# EasyEDA schematic SCH_ESP32 Controller PoE_2022-09-25.json
TITLE: ESP-R8-POE-3; REV: 3; Date: 2021-06-01; Sheet: 1/1; Drawn By: Dan Copeland; Company: None
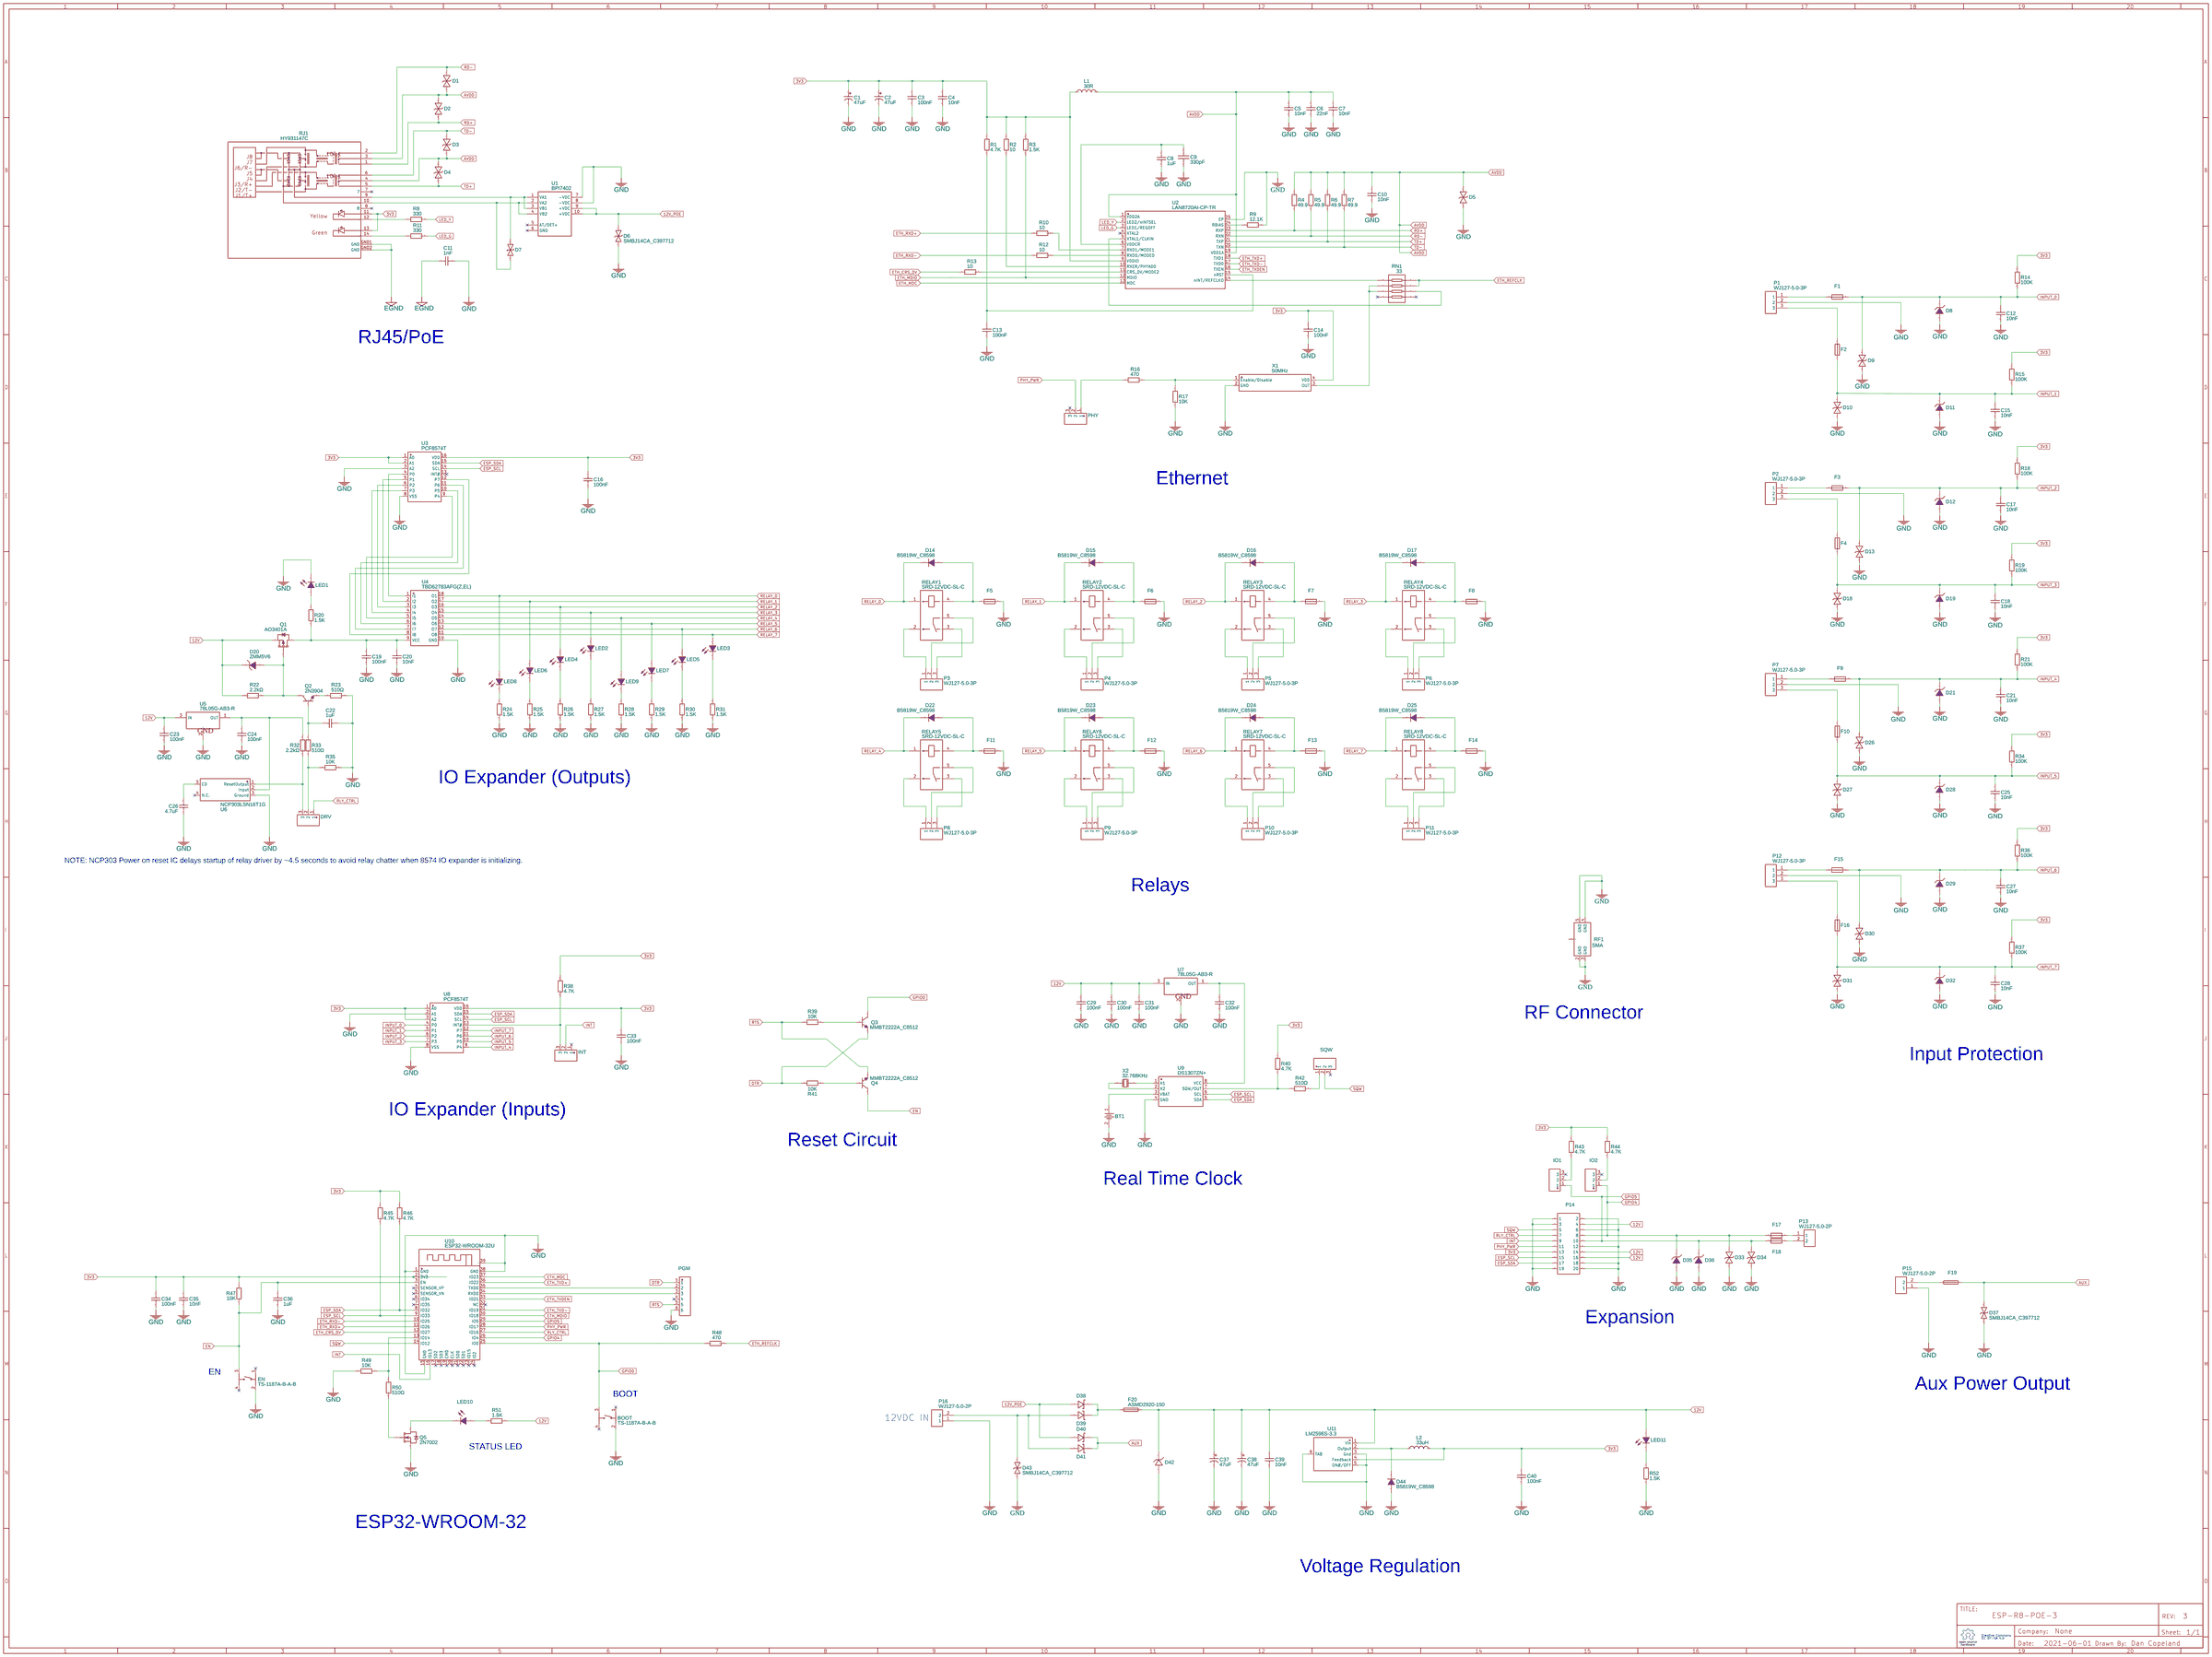
[diagram p0: schematic sheet]

## Parts
BOOT  TS-1187A-B-A-B  [SW-SMD_4P-L5.1-W5.1-P3.70-LS6.5-TL-2]
BT1  BS-12-A1AJ002-F  [BAT-TH_BS-12-A1AJ002-F]
C1  47uF  [CAP-TH_BD5.0-P2.00-D0.8-FD]
C2  47uF  [CAP-TH_BD5.0-P2.00-D0.8-FD]
C3  100nF  [C0402_NEW]
C4  10nF  [C0402]
C5  10nF  [C0402]
C6  22nF  [C0402]
C7  10nF  [C0402]
C8  1uF  [C0603]
C9  330pF  [C0402]
C10  10nF  [C0402]
C11  1nF  [C1206]
C12  10nF  [C0402]
C13  100nF  [C0402_NEW]
C14  100nF  [C0402_NEW]
C15  10nF  [C0402]
C16  100nF  [C0402_NEW]
C17  10nF  [C0402]
C18  10nF  [C0402]
C19  100nF  [C0402_NEW]
C20  10nF  [C0805]
C21  10nF  [C0402]
C22  1uF  [C0603]
C23  100nF  [C0402_NEW]
C24  100nF  [C0402_NEW]
C25  10nF  [C0402]
C26  4.7uF  [C1206]
C27  10nF  [C0402]
C28  10nF  [C0402]
C29  100nF  [C0402_NEW]
C30  100nF  [C0402_NEW]
C31  100nF  [C0402_NEW]
C32  100nF  [C0402_NEW]
C33  100nF  [C0402_NEW]
C34  100nF  [C0402_NEW]
C35  10nF  [C0402]
C36  1uF  [C0603]
C37  47uF  [CAP-TH_BD5.0-P2.00-D0.8-FD]
C38  47uF  [CAP-TH_BD5.0-P2.00-D0.8-FD]
C39  10nF  [C0805]
C40  100nF  [C0402_NEW]
D1  PESD03V32D-LC  [SOD-323_L1.7-W1.3-LS2.5-BI]
D2  PESD03V32D-LC  [SOD-323_L1.7-W1.3-LS2.5-BI]
D3  PESD03V32D-LC  [SOD-323_L1.7-W1.3-LS2.5-BI]
D4  PESD03V32D-LC  [SOD-323_L1.7-W1.3-LS2.5-BI]
D5  PESD03V32D-LC  [SOD-323_L1.7-W1.3-LS2.5-BI]
D6  SMBJ14CA_C397712  [SMB_L4.4-W3.6-LS5.4-BI]
D7  SMBJ64CA  [SMB_L4.6-W3.6-LS5.3-BI]
D8  ZMM3V3  [LL-34_L3.5-W1.5-RD]
D9  PESD03V32D-LC  [SOD-323_L1.7-W1.3-LS2.5-BI]
D10  PESD03V32D-LC  [SOD-323_L1.7-W1.3-LS2.5-BI]
D11  ZMM3V3  [LL-34_L3.5-W1.5-RD]
D12  ZMM3V3  [LL-34_L3.5-W1.5-RD]
D13  PESD03V32D-LC  [SOD-323_L1.7-W1.3-LS2.5-BI]
D14  B5819W_C8598  [SOD-123_L2.8-W1.8-LS3.7-RD]
D15  B5819W_C8598  [SOD-123_L2.8-W1.8-LS3.7-RD]
D16  B5819W_C8598  [SOD-123_L2.8-W1.8-LS3.7-RD]
D17  B5819W_C8598  [SOD-123_L2.8-W1.8-LS3.7-RD]
D18  PESD03V32D-LC  [SOD-323_L1.7-W1.3-LS2.5-BI]
D19  ZMM3V3  [LL-34_L3.5-W1.5-RD]
D20  ZMM5V6  [LL-34_L3.5-W1.5-RD]
D21  ZMM3V3  [LL-34_L3.5-W1.5-RD]
D22  B5819W_C8598  [SOD-123_L2.8-W1.8-LS3.7-RD]
D23  B5819W_C8598  [SOD-123_L2.8-W1.8-LS3.7-RD]
D24  B5819W_C8598  [SOD-123_L2.8-W1.8-LS3.7-RD]
D25  B5819W_C8598  [SOD-123_L2.8-W1.8-LS3.7-RD]
D26  PESD03V32D-LC  [SOD-323_L1.7-W1.3-LS2.5-BI]
D27  PESD03V32D-LC  [SOD-323_L1.7-W1.3-LS2.5-BI]
D28  ZMM3V3  [LL-34_L3.5-W1.5-RD]
D29  ZMM3V3  [LL-34_L3.5-W1.5-RD]
D30  PESD03V32D-LC  [SOD-323_L1.7-W1.3-LS2.5-BI]
D31  PESD03V32D-LC  [SOD-323_L1.7-W1.3-LS2.5-BI]
D32  ZMM3V3  [LL-34_L3.5-W1.5-RD]
D33  PESD03V32D-LC  [SOD-323_L1.7-W1.3-LS2.5-BI]
D34  PESD03V32D-LC  [SOD-323_L1.7-W1.3-LS2.5-BI]
D35  ZMM3V3  [LL-34_L3.5-W1.5-RD]
D36  ZMM3V3  [LL-34_L3.5-W1.5-RD]
D37  SMBJ14CA_C397712  [SMB_L4.4-W3.6-LS5.4-BI]
D38  SS34_C8678  [DO-214AC_L4.3-W2.7-LS5.3-RD]
D39  SS34_C8678  [DO-214AC_L4.3-W2.7-LS5.3-RD]
D40  SS34_C8678  [DO-214AC_L4.3-W2.7-LS5.3-RD]
D41  SS34_C8678  [DO-214AC_L4.3-W2.7-LS5.3-RD]
D42  2EZ13D5_C388131  [DO-41_BD2.4-L4.7-P8.70-D0.9-RD]
D43  SMBJ14CA_C397712  [SMB_L4.4-W3.6-LS5.4-BI]
D44  B5819W_C8598  [SOD-123_L2.8-W1.8-LS3.7-RD]
DRV  X1311WV-03J-C18D27  [HDR-TH_3P-P1.27-V-M]
EN  TS-1187A-B-A-B  [SW-SMD_4P-L5.1-W5.1-P3.70-LS6.5-TL-2]
F1  BSMD0603-002-60V  [F0603]
F2  BSMD0603-002-60V  [F0603]
F3  BSMD0603-002-60V  [F0603]
F4  BSMD0603-002-60V  [F0603]
F5  BSMD0603-025-16V  [F0603]
F6  BSMD0603-025-16V  [F0603]
F7  BSMD0603-025-16V  [F0603]
F8  BSMD0603-025-16V  [F0603]
F9  BSMD0603-002-60V  [F0603]
F10  BSMD0603-002-60V  [F0603]
F11  BSMD0603-025-16V  [F0603]
F12  BSMD0603-025-16V  [F0603]
F13  BSMD0603-025-16V  [F0603]
F14  BSMD0603-025-16V  [F0603]
F15  BSMD0603-002-60V  [F0603]
F16  BSMD0603-002-60V  [F0603]
F17  BSMD0603-002-60V  [F0603]
F18  BSMD0603-002-60V  [F0603]
F19  ASMD2920-075  [F2920]
F20  ASMD2920-150  [F2920]
INT  X1311WV-03J-C18D27  [HDR-TH_3P-P1.27-V-M]
IO1  X1311WV-03J-C18D27  [HDR-TH_3P-P1.27-V-M]
IO2  X1311WV-03J-C18D27  [HDR-TH_3P-P1.27-V-M]
L1  30R  [L0805]
L2  33uH  [IND-TH_BD9.0-P3.50-D0.6_VL0810]
LED1  19-217/BHC-ZL1M2RY/3T  [LED0603-R-RD]
LED2  19-217/BHC-ZL1M2RY/3T  [LED0603-R-RD]
LED3  19-217/BHC-ZL1M2RY/3T  [LED0603-R-RD]
LED4  19-217/BHC-ZL1M2RY/3T  [LED0603-R-RD]
LED5  19-217/BHC-ZL1M2RY/3T  [LED0603-R-RD]
LED6  19-217/BHC-ZL1M2RY/3T  [LED0603-R-RD]
LED7  19-217/BHC-ZL1M2RY/3T  [LED0603-R-RD]
LED8  19-217/BHC-ZL1M2RY/3T  [LED0603-R-RD]
LED9  19-217/BHC-ZL1M2RY/3T  [LED0603-R-RD]
LED10  19-217/BHC-ZL1M2RY/3T  [LED0603-R-RD]
LED11  19-217/BHC-ZL1M2RY/3T  [LED0603-R-RD]
P1  WJ127-5.0-3P  [CONN-TH_3P-P5.00_WJ127-5.0-3P]
P2  WJ127-5.0-3P  [CONN-TH_3P-P5.00_WJ127-5.0-3P]
P3  WJ127-5.0-3P  [CONN-TH_3P-P5.00_WJ127-5.0-3P]
P4  WJ127-5.0-3P  [CONN-TH_3P-P5.00_WJ127-5.0-3P]
P5  WJ127-5.0-3P  [CONN-TH_3P-P5.00_WJ127-5.0-3P]
P6  WJ127-5.0-3P  [CONN-TH_3P-P5.00_WJ127-5.0-3P]
P7  WJ127-5.0-3P  [CONN-TH_3P-P5.00_WJ127-5.0-3P]
P8  WJ127-5.0-3P  [CONN-TH_3P-P5.00_WJ127-5.0-3P]
P9  WJ127-5.0-3P  [CONN-TH_3P-P5.00_WJ127-5.0-3P]
P10  WJ127-5.0-3P  [CONN-TH_3P-P5.00_WJ127-5.0-3P]
P11  WJ127-5.0-3P  [CONN-TH_3P-P5.00_WJ127-5.0-3P]
P12  WJ127-5.0-3P  [CONN-TH_3P-P5.00_WJ127-5.0-3P]
P13  WJ127-5.0-2P  [CONN-TH_2P-P5.00_CPC3703CTR]
P14  Header-Female-2.54_2x10  [HDR-TH_20P-P2.54-V-R2-C10-S2.54]
P15  WJ127-5.0-2P  [CONN-TH_2P-P5.00_CPC3703CTR]
P16  WJ127-5.0-2P  [CONN-TH_2P-P5.00_CPC3703CTR]
PGM  PZ254V-11-06P  [HDR-TH_6P-P2.54-V-M]
PHY  X1311WV-03J-C18D27  [HDR-TH_3P-P1.27-V-M]
Q1  AO3401A  [SOT-23_L2.9-W1.3-P1.90-LS2.4-BR]
Q2  2N3904  [SOT-23-3_L2.9-W1.3-P1.90-LS2.4-BR]
Q3  MMBT2222A_C8512  [SOT-23-3_L2.9-W1.3-P1.90-LS2.4-BR]
Q4  MMBT2222A_C8512  [SOT-23-3_L2.9-W1.3-P1.90-LS2.4-BR]
Q5  2N7002  [SOT-23-3_L2.9-W1.3-P1.90-LS2.4-BR]
R1  4.7K  [R0402]
R2  10  [R0402]
R3  1.5K  [R0402]
R4  49.9  [R0402]
R5  49.9  [R0402]
R6  49.9  [R0402]
R7  49.9  [R0402]
R8  330  [R0402]
R9  12.1K  [R0402]
R10  10  [R0402]
R11  330  [R0402]
R12  10  [R0402]
R13  10  [R0402]
R14  100K  [R0402]
R15  100K  [R0402]
R16  470  [R0402]
R17  10K  [R0402]
R18  100K  [R0402]
R19  100K  [R0402]
R20  1.5K  [R0603]
R21  100K  [R0402]
R22  2.2kΩ  [R0402]
R23  510Ω  [R0402]
R24  1.5K  [R0603]
R25  1.5K  [R0603]
R26  1.5K  [R0603]
R27  1.5K  [R0603]
R28  1.5K  [R0603]
R29  1.5K  [R0603]
R30  1.5K  [R0603]
R31  1.5K  [R0603]
R32  2.2kΩ  [R0402]
R33  510Ω  [R0402]
R34  100K  [R0402]
R35  10K  [R0402]
R36  100K  [R0402]
R37  100K  [R0402]
R38  4.7K  [R0402]
R39  10K  [R0402]
R40  4.7K  [R0402]
R41  10K  [R0402]
R42  510Ω  [R0402]
R43  4.7K  [R0402]
R44  4.7K  [R0402]
R45  4.7K  [R0402]
R46  4.7K  [R0402]
R47  10K  [R0402]
R48  470  [R0402]
R49  10K  [R0402]
R50  510Ω  [R0402]
R51  1.5K  [R0603]
R52  1.5K  [R0603]
RELAY1  SRD-12VDC-SL-C  [RELAY-TH_SRD-XXVDC-XL-C]
RELAY2  SRD-12VDC-SL-C  [RELAY-TH_SRD-XXVDC-XL-C]
RELAY3  SRD-12VDC-SL-C  [RELAY-TH_SRD-XXVDC-XL-C]
RELAY4  SRD-12VDC-SL-C  [RELAY-TH_SRD-XXVDC-XL-C]
RELAY5  SRD-12VDC-SL-C  [RELAY-TH_SRD-XXVDC-XL-C]
RELAY6  SRD-12VDC-SL-C  [RELAY-TH_SRD-XXVDC-XL-C]
RELAY7  SRD-12VDC-SL-C  [RELAY-TH_SRD-XXVDC-XL-C]
RELAY8  SRD-12VDC-SL-C  [RELAY-TH_SRD-XXVDC-XL-C]
RF1  SMA  [SMA-TH_HJ-SMA200]
RJ1  HY931147C  [RJ45-TH_HY931147C]
RN1  33  [RES-ARRAY-SMD_0402-8P-L2.0-W1.0-BL]
SQW  X1311WV-03J-C18D27  [HDR-TH_3P-P1.27-V-M]
U1  BPI7402  [BPI7402]
U2  LAN8720AI-CP-TR  [QFN-24_L4.0-W4.0-P0.50-BL-EP2.6]
U3  PCF8574T  [SO-16_L10.3-W7.5-P1.27-LS10.3-BL]
U4  TBD62783AFG(Z,EL)  [SOP-18_L13.0-W7.0-P1.27-LS10.3-BL]
U5  78L05G-AB3-R  [SOT-89-3_L4.5-W2.5-P1.50-LS4.2-BR]
U6  NCP303LSN16T1G  [TSOP-5_L3.0-W1.5-P0.95-LS2.8-BL]
U7  78L05G-AB3-R  [SOT-89-3_L4.5-W2.5-P1.50-LS4.2-BR]
U8  PCF8574T  [SO-16_L10.3-W7.5-P1.27-LS10.3-BL]
U9  DS1307ZN+  [SOP-8_L4.9-W3.9-P1.27-LS6.0-BL]
U10  ESP32-WROOM-32U  [WIFIM-SMD_38P-L19.2-W18.0-P1.27]
U11  LM2596S-3.3  [TO-263-5_L10.0-W8.4-P1.70-LS15.3-BR]
X1  50MHz  [OSC-SMD_4P-L7.0-W5.0-BL]
X2  32.768KHz  [OSC-TH_BD3.1-P0.8-D0.3]

## Library data of the parts
BOOT EN = TS-1187A-B-A-B: Supplier: LCSC; Supplier Part: C318884; Manufacturer: XKB Enterprise; Contributor: LCSC; JLCPCB Part Class: Basic Part
BT1 = BS-12-A1AJ002-F: Supplier: LCSC; Supplier Part: C964720; Manufacturer: MYOUNG(美阳); Contributor: LCSC; JLCPCB Part Class: Extended Part
C1 C2 C37 C38 = 16MS747MEFC5X7: Supplier: LCSC; Manufacturer: Rubycon; Contributor: LCSC; Supplier Part: C108854; JLCPCB Part Class: Extended Part
C3 C13 C14 C16 C19 C23 C24 C29-C34 C40 = CL05B104KO5NNNC: Supplier: LCSC; Manufacturer: SAMSUNG; Supplier Part: C1525; JLCPCB Part Class: Basic Part
C4 C5 C7 C10 C12 C15 C17 C18 C21 C25 C27 C28 C35 = CL05B103KB5NNNC: Supplier: LCSC; Manufacturer: SAMSUNG; Supplier Part: C15195; JLCPCB Part Class: Basic Part
C6 = 0402B223K500NT: Supplier: LCSC; Manufacturer: FH; Supplier Part: C1532; JLCPCB Part Class: Basic Part
C8 C22 C36 = CL10A105KB8NNNC: Supplier: LCSC; Manufacturer: SAMSUNG; Supplier Part: C15849; JLCPCB Part Class: Basic Part
C9 = CL05C331JB5NNNC: Supplier: LCSC; Manufacturer: SAMSUNG; Supplier Part: C13533; JLCPCB Part Class: Basic Part
C11 = 1206B102K202NT: Supplier: LCSC; Manufacturer: FH; Supplier Part: C9196; JLCPCB Part Class: Extended Part
C20 C39 = CL21B103KBANNNC: Supplier: LCSC; Manufacturer: SAMSUNG; Supplier Part: C1710; JLCPCB Part Class: Basic Part
C26 = 1206B475K500NT: Supplier: LCSC; Manufacturer: FH; Supplier Part: C29823; JLCPCB Part Class: Basic Part
D1-D5 D9 D10 D13 D18 D26 D27 D30 D31 D33 D34 = PESD03V32D-LC: Supplier: LCSC; Supplier Part: C2912528; Manufacturer: TECH PUBLIC(台舟); JLCPCB Part Class: Extended Part; Contributor: LCSC
D6 D37 D43 = SMBJ14CA_C397712: Supplier: LCSC; Supplier Part: C397712; Manufacturer: AnBon; Manufacturer Part: SMBJ14CA; Contributor: LCSC; JLCPCB Part Class: Extended Part
D7 = SMBJ64CA_C123975: Supplier: LCSC; Supplier Part: C123975; Manufacturer: Brightking Elec (TAIWAN); Contributor: LCSC; JLCPCB Part Class: Extended Part
D8 D11 D12 D19 D21 D28 D29 D32 D35 D36 = ZMM3V3: Supplier: LCSC; Manufacturer: SEMTECH; Supplier Part: C8056; JLCPCB Part Class: Basic Part
D14-D17 D22-D25 D44 = B5819W_C8598: Supplier: LCSC; Manufacturer: CJ; Manufacturer Part: B5819W; Supplier Part: C8598; JLCPCB Part Class: Basic Part
D20 = ZMM5V6: Supplier: LCSC; Manufacturer: SEMTECH; Supplier Part: C8062; JLCPCB Part Class: Basic Part
D38-D41 = SS34_C8678: Supplier: LCSC; Manufacturer Part: SS34; Manufacturer: MDD; Supplier Part: C8678; JLCPCB Part Class: Basic Part
D42 = 2EZ13D5_C388131: Supplier: LCSC; Supplier Part: C388131; Manufacturer: SUNMATE Elec; Manufacturer Part: 2EZ13D5; Contributor: LCSC; JLCPCB Part Class: Extended Part
DRV INT IO1 IO2 PHY SQW = X1311WV-03J-C18D27: Supplier: LCSC; Supplier Part: C2881648; Manufacturer: XKB Connectivity(中国星坤); Contributor: LCSC; JLCPCB Part Class: Extended Part
F1-F4 F9 F10 F15-F18 = BSMD0603-002-60V: Supplier: LCSC; Supplier Part: C914089; Manufacturer: BHFUSE; Contributor: LCSC; JLCPCB Part Class: Extended Part; Package Display: No
F5-F8 F11-F14 = BSMD0603-025-16V: Supplier: LCSC; Supplier Part: C883094; Manufacturer: BHFUSE; Contributor: LCSC; JLCPCB Part Class: Extended Part
F19 = ASMD2920-075: Supplier: LCSC; Manufacturer: JDTFUSE; Contributor: LCSC; Supplier Part: C135375; JLCPCB Part Class: Extended Part; Package Display: No
F20 = ASMD2920-150: Supplier: LCSC; Manufacturer: JDTFUSE; Contributor: LCSC; Supplier Part: C135378; JLCPCB Part Class: Extended Part
L1 = SBM2012G300LSP: Supplier: LCSC; Supplier Part: C216133; Manufacturer: Sunltech Tech; Contributor: LCSC; JLCPCB Part Class: Extended Part
L2 = VLU0810-330K: Supplier: LCSC; Manufacturer: FH; Supplier Part: C72622; JLCPCB Part Class: Extended Part
LED1-LED11 = 19-217/BHC-ZL1M2RY/3T: Supplier: LCSC; Manufacturer: EVERLIGHT; Supplier Part: C72041; JLCPCB Part Class: Basic Part
P1-P12 = WJ127-5.0-3P: Supplier: LCSC; Manufacturer: ReliaPro; Supplier Part: C8393; JLCPCB Part Class: Extended Part
P13 P15 P16 = WJ127-5.0-2P: Supplier: LCSC; Manufacturer: ReliaPro; Supplier Part: C3703; JLCPCB Part Class: Extended Part
P14 = Header-Female-2.54_2x10: Supplier: LCSC; Manufacturer: BOOMELE; Manufacturer Part: 2.54mm,2×10Double row female; Supplier Part: C30867; JLCPCB Part Class: Extended Part
PGM = PZ254V-11-06P: Supplier: LCSC; Supplier Part: C492405; Manufacturer: XFCN; Contributor: LCSC; JLCPCB Part Class: Extended Part
Q1 = AO3401A: Supplier: LCSC; Manufacturer: AOS; Supplier Part: C15127; JLCPCB Part Class: Basic Part
Q2 = MMBT3904-C20526: Supplier: LCSC; Manufacturer: CJ; Manufacturer Part: MMBT3904; Supplier Part: C20526; Contributor: 立创EDA官方封装库; JLCPCB Part Class: Basic Part; Package Display: No
Q3 Q4 = MMBT2222A_C8512: Supplier: LCSC; Manufacturer: CJ; Manufacturer Part: MMBT2222A; Supplier Part: C8512; JLCPCB Part Class: Basic Part
Q5 = 2N7002: Supplier: LCSC; Manufacturer: CJ; Supplier Part: C8545; JLCPCB Part Class: Basic Part
R1 R38 R40 R43-R46 = 0402WGF4701TCE: Supplier: LCSC; Manufacturer: UniOhm; Supplier Part: C25900; JLCPCB Part Class: Basic Part
R2 R10 R12 R13 = 0402WGF100JTCE: Supplier: LCSC; Manufacturer: UniOhm; Supplier Part: C25077; JLCPCB Part Class: Basic Part
R3 = 0402WGF1501TCE: Supplier: LCSC; Manufacturer: UniOhm; Supplier Part: C25867; JLCPCB Part Class: Basic Part
R4-R7 = 0402WGF499JTCE: Supplier: LCSC; Manufacturer: UniOhm; Supplier Part: C25120; JLCPCB Part Class: Basic Part
R8 R11 = 0402WGF3300TCE: Supplier: LCSC; Manufacturer: UniOhm; Supplier Part: C25104; JLCPCB Part Class: Basic Part
R9 = 0402WGF1212TCE: Supplier: LCSC; Manufacturer: UniOhm; Supplier Part: C25852; JLCPCB Part Class: Extended Part
R14 R15 R18 R19 R21 R34 R36 R37 = 0402WGF1003TCE: Supplier: LCSC; Manufacturer: UniOhm; Supplier Part: C25741; JLCPCB Part Class: Basic Part
R16 R48 = 0402WGF4700TCE: Supplier: LCSC; Manufacturer: UniOhm; Supplier Part: C25117; JLCPCB Part Class: Basic Part
R17 R35 R39 R41 R47 R49 = 0402WGF1002TCE: Supplier: LCSC; Manufacturer: UniOhm; Supplier Part: C25744; JLCPCB Part Class: Basic Part
R20 R24-R31 R51 R52 = 0603WAF1501T5E: Supplier: LCSC; Manufacturer: UniOhm; Supplier Part: C22843; JLCPCB Part Class: Basic Part
R22 R32 = 0402WGF2201TCE: Supplier: LCSC; Manufacturer: UniOhm; Supplier Part: C25879; Resistance (Ohms): 2.2K; JLCPCB Part Class: Basic Part
R23 R33 R42 R50 = 0402WGF5100TCE: Supplier: LCSC; Manufacturer: UniOhm; Supplier Part: C25123; Resistance (Ohms): 510; JLCPCB Part Class: Basic Part
RELAY1-RELAY8 = SRD-12VDC-SL-C: Supplier: LCSC; Manufacturer: SONGLE; Supplier Part: C30431; JLCPCB Part Class: Extended Part
RF1 = HJ-SMA200: Supplier: LCSC; Supplier Part: C1509215; Manufacturer: 皇捷; Contributor: LCSC; JLCPCB Part Class: Extended Part
RJ1 = HY931147C: Supplier: LCSC; Manufacturer: HANRUN; Supplier Part: C91754; JLCPCB Part Class: Extended Part
RN1 = 4D02WGJ0330TCE: Supplier: LCSC; Manufacturer: UniOhm; Supplier Part: C25501; JLCPCB Part Class: Basic Part
U1 = BPI7402: Contributor: dirtypolecat
U2 = LAN8720AI-CP-TR: Supplier: LCSC; Manufacturer: SMSC; Supplier Part: C17146; JLCPCB Part Class: Extended Part
U3 U8 = PCF8574T_C2973152: Supplier: LCSC; Supplier Part: C2973152; Manufacturer: HGSEMI(华冠); link: https://atta.szlcsc.com//upload/public/pdf/source/20190611/C398075_1925312D8618E19C6137781D5B71A3CA.pdf; Contributor: LCSC; JLCPCB Part Class: Extended Part
U4 = TBD62783AFG(Z,EL): Supplier: LCSC; Supplier Part: C840444; Manufacturer: TOSHIBA(东芝); Contributor: LCSC; JLCPCB Part Class: Extended Part
U5 U7 = 78L05G-AB3-R: Supplier: LCSC; Manufacturer: UTC; Supplier Part: C71136; JLCPCB Part Class: Basic Part
U6 = NCP303LSN16T1G: Supplier: LCSC; Supplier Part: C892351; Manufacturer: onsemi(安森美); Contributor: LCSC
U9 = DS1307ZN+: Supplier: LCSC; Manufacturer: MAXIM; Supplier Part: C26858; JLCPCB Part Class: Extended Part
U10 = ESP32-WROOM-32U: Supplier: LCSC; Supplier Part: C328062; Manufacturer: Espressif Systems; Contributor: LCSC; JLCPCB Part Class: Extended Part
U11 = LM2596S-3.3: Supplier: LCSC; Supplier Part: C347420; Manufacturer: UMW(Youtai Semiconductor Co., Ltd.); Contributor: LCSC; Paste Type: Extended Part; JLCPCB Part Class: Extended Part
X1 = OT705050MJBA4SL: Supplier: LCSC; Supplier Part: C669094; Manufacturer: Yangxing Tech; Contributor: LCSC; JLCPCB Part Class: Extended Part
X2 = TDXLF-308 32.768KHZ 12.5PF 20PPM: Supplier: LCSC; Supplier Part: C145164; Manufacturer: Zhejiang Abel Elec; Contributor: LCSC; JLCPCB Part Class: Extended Part

## Nets
3V3: C1.1 C2.1 C3.1 C4.1 C14.1 C16.1 C33.1 C34.1 C35.1 C40.1 L1.1 L2.2 P14.13 R1.1 R2.1 R3.1 R14.1 R15.1 R18.1 R19.1 R21.1 R34.1 R36.1 R37.1 R38.1 R40.1 R43.1 R44.1 R45.1 R46.1 R47.1 RJ1.11 RJ1.13 U2.9(VDDIO) U3.1(A0) U3.2(A1) U3.16(VDD) U8.1(A0) U8.3(A2) U8.16(VDD) U10.2(3V3) U11.4(Feedback) X1.4(VDD)
12V: C23.1 C29.1 C30.1 C31.1 C37.1 C38.1 C39.1 D20.1(C) D42.1(C) F20.2 LED11.1(A) P14.4 P14.14 P14.16 Q1.2(S) R22.1 R51.1 U5.3(IN) U7.3(IN) U11.1(Vin)
12V_POE: D6.1 D38.2(A) D40.2(A) U1.9(+VDC) U1.10(+VDC)
AVDD: C5.1 C6.1 C7.1 C10.1 D1.2 D2.1 D3.2 D4.1 D5.1 L1.2 R4.1 R5.1 R6.1 R7.1 RJ1.3 RJ1.4 U2.1(VDD2A) U2.19(VDD1A)
GND: BOOT.2(B) BT1.2 C1.2 C2.2 C3.2 C4.2 C5.2 C6.2 C7.2 C8.2 C9.2 C10.2 C11.2 C12.2 C13.2 C14.2 C15.2 C16.2 C17.2 C18.2 C19.2 C20.2 C21.2 C22.2 C23.2 C24.2 C25.2 C26.1 C27.2 C28.2 C29.2 C30.2 C31.2 C32.2 C33.2 C34.2 C35.2 C36.2 C37.2 C38.2 C39.2 C40.2 D5.2 D6.2 D8.2(A) D9.2 D10.2 D11.2(A) D12.2(A) D13.2 D18.2 D19.2(A) D21.2(A) D26.2 D27.2 D28.2(A) D29.2(A) D30.2 D31.2 D32.2(A) D33.2 D34.2 D35.2(A) D36.2(A) D37.2 D42.2(A) D43.2 D44.2(+) EN.2(B) F5.2 F6.2 F7.2 F8.2 F11.2 F12.2 F13.2 F14.2 LED1.2(C) P1.2 P2.2 P7.2 P12.2 P14.1 P14.2 P14.3 P14.6 P14.12 P14.18 P14.19 P14.20 P15.1 P16.1 PGM.6 Q5.2(S) R9.2 R17.2 R23.2 R24.2 R25.2 R26.2 R27.2 R28.2 R29.2 R30.2 R31.2 R35.1 R49.2 R52.2 RF1.2(GND) RF1.3(GND) RF1.4(GND) RF1.5(GND) U1.7(-VDC) U1.8(-VDC) U2.25(EP) U3.3(A2) U3.8(VSS) U4.10(GND) U5.2(GND) U6.3(Ground) U7.2(GND) U8.2(A1) U8.8(VSS) U9.4(GND) U10.1(GND) U10.15(GND) U10.38(GND) U10.39(GND) U11.3(Gnd) U11.5(ON#/OFF) U11.6(TAB) X1.2(GND)
AUX: D37.1 D40.1(K) D41.1(K) F19.2
DTR: PGM.1 Q3.2(E) R41.2
EGND: C11.1 RJ1.GND1(GND) RJ1.GND2(GND)
EN: C36.1 EN.3(C) Q4.3(C) R47.2 U10.3(EN)
ESP_SCL: P14.15 R45.2 U3.14(SCL) U8.14(SCL) U9.6(SCL) U10.9(IO33)
ESP_SDA: P14.17 R46.2 U3.15(SDA) U8.15(SDA) U9.5(SDA) U10.8(IO32)
ETH_CRS_DV: R13.1 U10.12(IO27)
ETH_MDC: U2.13(MDC) U10.37(IO23)
ETH_MDIO: R3.2 U2.12(MDIO) U10.30(IO18)
ETH_REFCLK: R48.2 RN1.1 RN1.2
ETH_RXD+: R10.1 U10.11(IO26)
ETH_RXD-: R12.1 U10.10(IO25)
ETH_TXD+: U2.18(TXD1) U10.36(IO22)
ETH_TXD-: U2.17(TXD0) U10.31(IO19)
ETH_TXDEN: U2.16(TXEN) U10.33(IO21)
GPIO0: BOOT.3(C) Q3.3(C) R48.1 U10.25(IO0)
GPIO4: D33.1 D35.1(C) F17.1 IO2.1 P14.8 U10.26(IO4)
GPIO5: D34.1 D36.1(C) F18.1 IO1.1 P14.10 U10.29(IO5)
INPUT_0: C12.1 D8.1(C) D9.1 F1.2 R14.2 U8.4(P0)
INPUT_1: C15.1 D10.1 D11.1(C) F2.1 R15.2 U8.5(P1)
INPUT_2: C17.1 D12.1(C) D13.1 F3.2 R18.2 U8.6(P2)
INPUT_3: C18.1 D18.1 D19.1(C) F4.1 R19.2 U8.7(P3)
INPUT_4: C21.1 D21.1(C) D26.1 F9.2 R21.2 U8.9(P4)
INPUT_5: C25.1 D27.1 D28.1(C) F10.1 R34.2 U8.10(P5)
INPUT_6: C27.1 D29.1(C) D30.1 F15.2 R36.2 U8.11(P6)
INPUT_7: C28.1 D31.1 D32.1(C) F16.1 R37.2 U8.12(P7)
INT: INT.2 P14.9 U10.16(IO13)
LED_G: R11.2 U2.3(LED1/REGOFF)
LED_Y: R8.2 U2.2(LED2/nINTSEL)
PHY_PWR: P14.11 PHY.2 U10.28(IO17)
RD+: D2.2 R4.2 RJ1.1 U2.23(RXP)
RD-: D1.1 R5.2 RJ1.2 U2.22(RXN)
RELAY_0: D14.1(-) LED8.1(A) RELAY1.1 U4.18(O1)
RELAY_1: D15.1(-) LED6.1(A) RELAY2.1 U4.17(O2)
RELAY_2: D16.1(-) LED4.1(A) RELAY3.1 U4.16(O3)
RELAY_3: D17.1(-) LED2.1(A) RELAY4.1 U4.15(O4)
RELAY_4: D22.1(-) LED9.1(A) RELAY5.1 U4.14(O5)
RELAY_5: D23.1(-) LED7.1(A) RELAY6.1 U4.13(O6)
RELAY_6: D24.1(-) LED5.1(A) RELAY7.1 U4.12(O7)
RELAY_7: D25.1(-) LED3.1(A) RELAY8.1 U4.11(O8)
RLY_CTRL: DRV.1 P14.7 U10.27(IO16)
RTS: PGM.5 Q4.2(E) R39.2
SQW: P14.5 SQW.2 U10.14(IO12)
TD+: D4.2 R6.2 RJ1.5 U2.21(TXP)
TD-: D3.1 R7.2 RJ1.6 U2.20(TXN)
Net-(BT1-1): BT1.1 U9.3(VBAT)
Net-(C8-1): C8.1 C9.1 U2.6(VDDCR)
Net-(C13-1): C13.1 R1.2 U2.15(nRST)
Net-(C19-1): C19.1 C20.1 Q1.3(D) R20.2 U4.9(VCC)
Net-(C22-1): C22.1 Q2.1(B) R33.1
Net-(C24-1): C24.1 R32.1 U5.1(OUT) U6.2(Input)
Net-(C26-2): C26.2 U6.5(CD)
Net-(C32-1): C32.1 U7.1(OUT) U9.8(VCC)
Net-(D7-1): D7.1 RJ1.9 U1.1(VA1) U1.3(VB1)
Net-(D7-2): D7.2 RJ1.10 U1.2(VA2) U1.4(VB2)
Net-(D14-2): D14.2(+) F5.1 RELAY1.4
Net-(D15-2): D15.2(+) F6.1 RELAY2.4
Net-(D16-2): D16.2(+) F7.1 RELAY3.4
Net-(D17-2): D17.2(+) F8.1 RELAY4.4
Net-(D20-2): D20.2(A) Q1.1(G) Q2.3(C) R22.2
Net-(D22-2): D22.2(+) F11.1 RELAY5.4
Net-(D23-2): D23.2(+) F12.1 RELAY6.4
Net-(D24-2): D24.2(+) F13.1 RELAY7.4
Net-(D25-2): D25.2(+) F14.1 RELAY8.4
Net-(D38-1): D38.1(K) D39.1(K) F20.1
Net-(D39-2): D39.2(A) D41.2(A) D43.1 P16.2
Net-(D44-1): D44.1(-) L2.1 U11.2(Output)
Net-(DRV-2): DRV.2 R33.2 R35.2
Net-(DRV-3): DRV.3 R32.2 U6.1(ResetOutput)
Net-(F1-1): F1.1 P1.1
Net-(F2-2): F2.2 P1.3
Net-(F3-1): F3.1 P2.1
Net-(F4-2): F4.2 P2.3
Net-(F9-1): F9.1 P7.1
Net-(F10-2): F10.2 P7.3
Net-(F15-1): F15.1 P12.1
Net-(F16-2): F16.2 P12.3
Net-(F17-2): F17.2 P13.1
Net-(F18-2): F18.2 P13.2
Net-(F19-1): F19.1 P15.2
Net-(INT-3): INT.3 R38.2 U8.13(INT#)
Net-(IO1-2): IO1.2 R43.2
Net-(IO2-2): IO2.2 R44.2
Net-(LED1-1): LED1.1(A) R20.1
Net-(LED2-2): LED2.2(C) R27.1
Net-(LED3-2): LED3.2(C) R31.1
Net-(LED4-2): LED4.2(C) R26.1
Net-(LED5-2): LED5.2(C) R30.1
Net-(LED6-2): LED6.2(C) R25.1
Net-(LED7-2): LED7.2(C) R29.1
Net-(LED8-2): LED8.2(C) R24.1
Net-(LED9-2): LED9.2(C) R28.1
Net-(LED10-1): LED10.1(A) R51.2
Net-(LED10-2): LED10.2(C) Q5.3(D)
Net-(LED11-2): LED11.2(C) R52.1
Net-(P3-1): P3.1 RELAY1.2
Net-(P3-2): P3.2 RELAY1.5
Net-(P3-3): P3.3 RELAY1.3
Net-(P4-1): P4.1 RELAY2.2
Net-(P4-2): P4.2 RELAY2.5
Net-(P4-3): P4.3 RELAY2.3
Net-(P5-1): P5.1 RELAY3.2
Net-(P5-2): P5.2 RELAY3.5
Net-(P5-3): P5.3 RELAY3.3
Net-(P6-1): P6.1 RELAY4.2
Net-(P6-2): P6.2 RELAY4.5
Net-(P6-3): P6.3 RELAY4.3
Net-(P8-1): P8.1 RELAY5.2
Net-(P8-2): P8.2 RELAY5.5
Net-(P8-3): P8.3 RELAY5.3
Net-(P9-1): P9.1 RELAY6.2
Net-(P9-2): P9.2 RELAY6.5
Net-(P9-3): P9.3 RELAY6.3
Net-(P10-1): P10.1 RELAY7.2
Net-(P10-2): P10.2 RELAY7.5
Net-(P10-3): P10.3 RELAY7.3
Net-(P11-1): P11.1 RELAY8.2
Net-(P11-2): P11.2 RELAY8.5
Net-(P11-3): P11.3 RELAY8.3
Net-(PGM-2): PGM.2 U10.35(TXD0)
Net-(PGM-3): PGM.3 U10.34(RXD0)
Net-(PHY-1): PHY.1 R16.1
Net-(Q2-2): Q2.2(E) R23.1
Net-(Q3-1): Q3.1(B) R39.1
Net-(Q4-1): Q4.1(B) R41.1
Net-(Q5-1): Q5.1(G) R50.2
Net-(R2-2): R2.2 U2.10(RXER/PHYAD0)
Net-(R8-1): R8.1 RJ1.12
Net-(R9-1): R9.1 U2.24(RBIAS)
Net-(R10-2): R10.2 U2.7(RXD1/MODE1)
Net-(R11-1): R11.1 RJ1.14
Net-(R12-2): R12.2 U2.8(RXD0/MODE0)
Net-(R13-2): R13.2 U2.11(CRS_DV/MODE2)
Net-(R16-2): R16.2 R17.1 X1.1(Enable/Disable)
Net-(R40-2): R40.2 R42.1 U9.7(SQW/OUT)
Net-(R42-2): R42.2 SQW.1
Net-(R49-1): R49.1 R50.1 U10.13(IO14)
Net-(RN1-3): RN1.3 U2.5(XTAL1/CLKIN)
Net-(RN1-6): RN1.6 RN1.7 X1.3(OUT)
Net-(RN1-8): RN1.8 U2.14(nINT/REFCLKO)
Net-(U3-4): U3.4(P0) U4.1(I1)
Net-(U3-5): U3.5(P1) U4.2(I2)
Net-(U3-6): U3.6(P2) U4.3(I3)
Net-(U3-7): U3.7(P3) U4.4(I4)
Net-(U3-9): U3.9(P4) U4.5(I5)
Net-(U3-10): U3.10(P5) U4.6(I6)
Net-(U3-11): U3.11(P6) U4.7(I7)
Net-(U3-12): U3.12(P7) U4.8(I8)
Net-(U9-1): U9.1(X1) X2.1(OSC1)
Net-(U9-2): U9.2(X2) X2.2(OSC2)

Not connected (* = marked no-connect by the designer): BOOT 1(A)* 4(D)*; EN 1(A)* 4(D)*; INT 1*; IO1 3*; IO2 3*; PGM 4*; PHY 3*; RF1 1(SIG); RJ1 7* 8*; RN1 4* 5*; SQW 3*; U1 5(AT/DET+)* 6(GND)*; U2 4(XTAL2)*; U3 13(INT#)*; U6 4(N.C.)*; U10 4(SENSOR_VP)* 5(SENSOR_VN)* 6(IO34)* 7(IO35)* 17(SD2)* 18(SD3)* 19(CMD)* 20(CLK)* 21(SD0)* 22(SD1)* 23(IO15)* 24(IO2)* 32(NC)*

## Notes on the sheet
- RJ45/PoE
- Ethernet
- IO Expander (Outputs)
- NOTE: NCP303 Power on reset IC delays startup of relay driver by ~4.5 seconds to avoid relay chatter when 8574 IO expander is initializing.
- Relays
- RF Connector
- Input Protection
- IO Expander (Inputs)
- Reset Circuit
- Real Time Clock
- Expansion
- EN
- Aux Power Output
- BOOT
- 12VDC IN
- STATUS LED
- ESP32-WROOM-32
- Voltage Regulation
- Creative Commons
- CC BY-SA 4.0
